# Altium schematic sheet power_ldo_fixed_sot223.SchDoc
size A
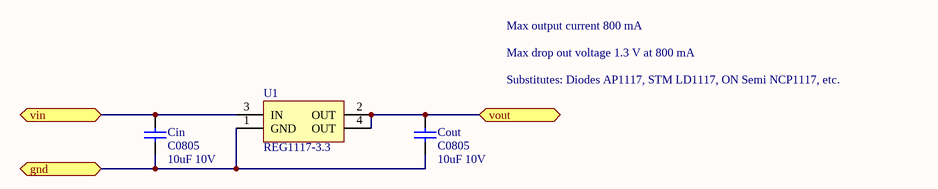
[diagram p0: power_ldo_fixed_sot223.SchDoc]

## Parts
Cin  C0805  value 10uF 10V  [0805]
Cout  C0805  value 10uF 10V  [0805]
U1  REG1117-3.3  [ZZ311]

## Ports
gnd, vin, vout

## Nets
gnd: Cin.2 Cout.2 U1.1(GND) ; port gnd
vin: Cin.1 U1.3(IN) ; port vin
vout: Cout.1 U1.2(OUT) U1.4(OUT) ; port vout

## Notes on the sheet
- Max drop out voltage 1.3 V at 800 mA
- Max output current 800 mA
- Substitutes: Diodes AP1117, STM LD1117, ON Semi NCP1117, etc.

## Library data of the parts
Cin Cout = C0805: Ceramic Chip Capacitor - Standard; Note: Footprint corresponds to dimensions for bulk cassette packaging. This case size has tightened tolerances.; Published: 17-Jul-2002; LatestRevisionDate: 19-Mar-2004; LatestRevisionNote: Silkscreen size reduced.; DatasheetDocument: Mar-2001; PackageDocument: Mar-2001; PackageReference: 0805; Publisher: Altium Limited; Code_JEITA: 0805; Code_IPC: 2012[0805]; ComponentLink1Description: Manufacturer Link; ComponentLink1URL: http://www.kemet.com/; ComponentLink2Description: Datasheet; ComponentLink2URL: http://www.kemet.com/kemet/web/homepage/kechome.nsf/vapubfilesname/F3102TA.pdf/$file/F3102TA.pdf
U1 = REG1117-3.3: 800mA and 1A Low Dropout Positive Regulator 2.85V, 3.3V, 5V, and Adjustable; Manufacturer: Texas Instruments; ManufacturerPartNumber: REG1117-3.3/2K5; Published: 8-Jun-2000; LatestRevisionDate: 17-Jul-2002; LatestRevisionNote: Re-released for DXP Platform.; DatasheetVersion: Sep-1997; PackageVersion: revC; PackageReference: ZZ311; Publisher: Altium Limited; PackageDescription: SOT-223/SC-73; 4 Leads; Body 6.7 x 7.3 mm, inc. leads (LxW max); ComponentLink1Description: Manufacturer Link; ComponentLink1URL: http://www.ti.com/; ComponentLink2Description: Datasheet; ComponentLink2URL: http://www-s.ti.com/sc/ds/REG1117.pdf